# EAGLE design Pacman (EAGLE 9.5.0)
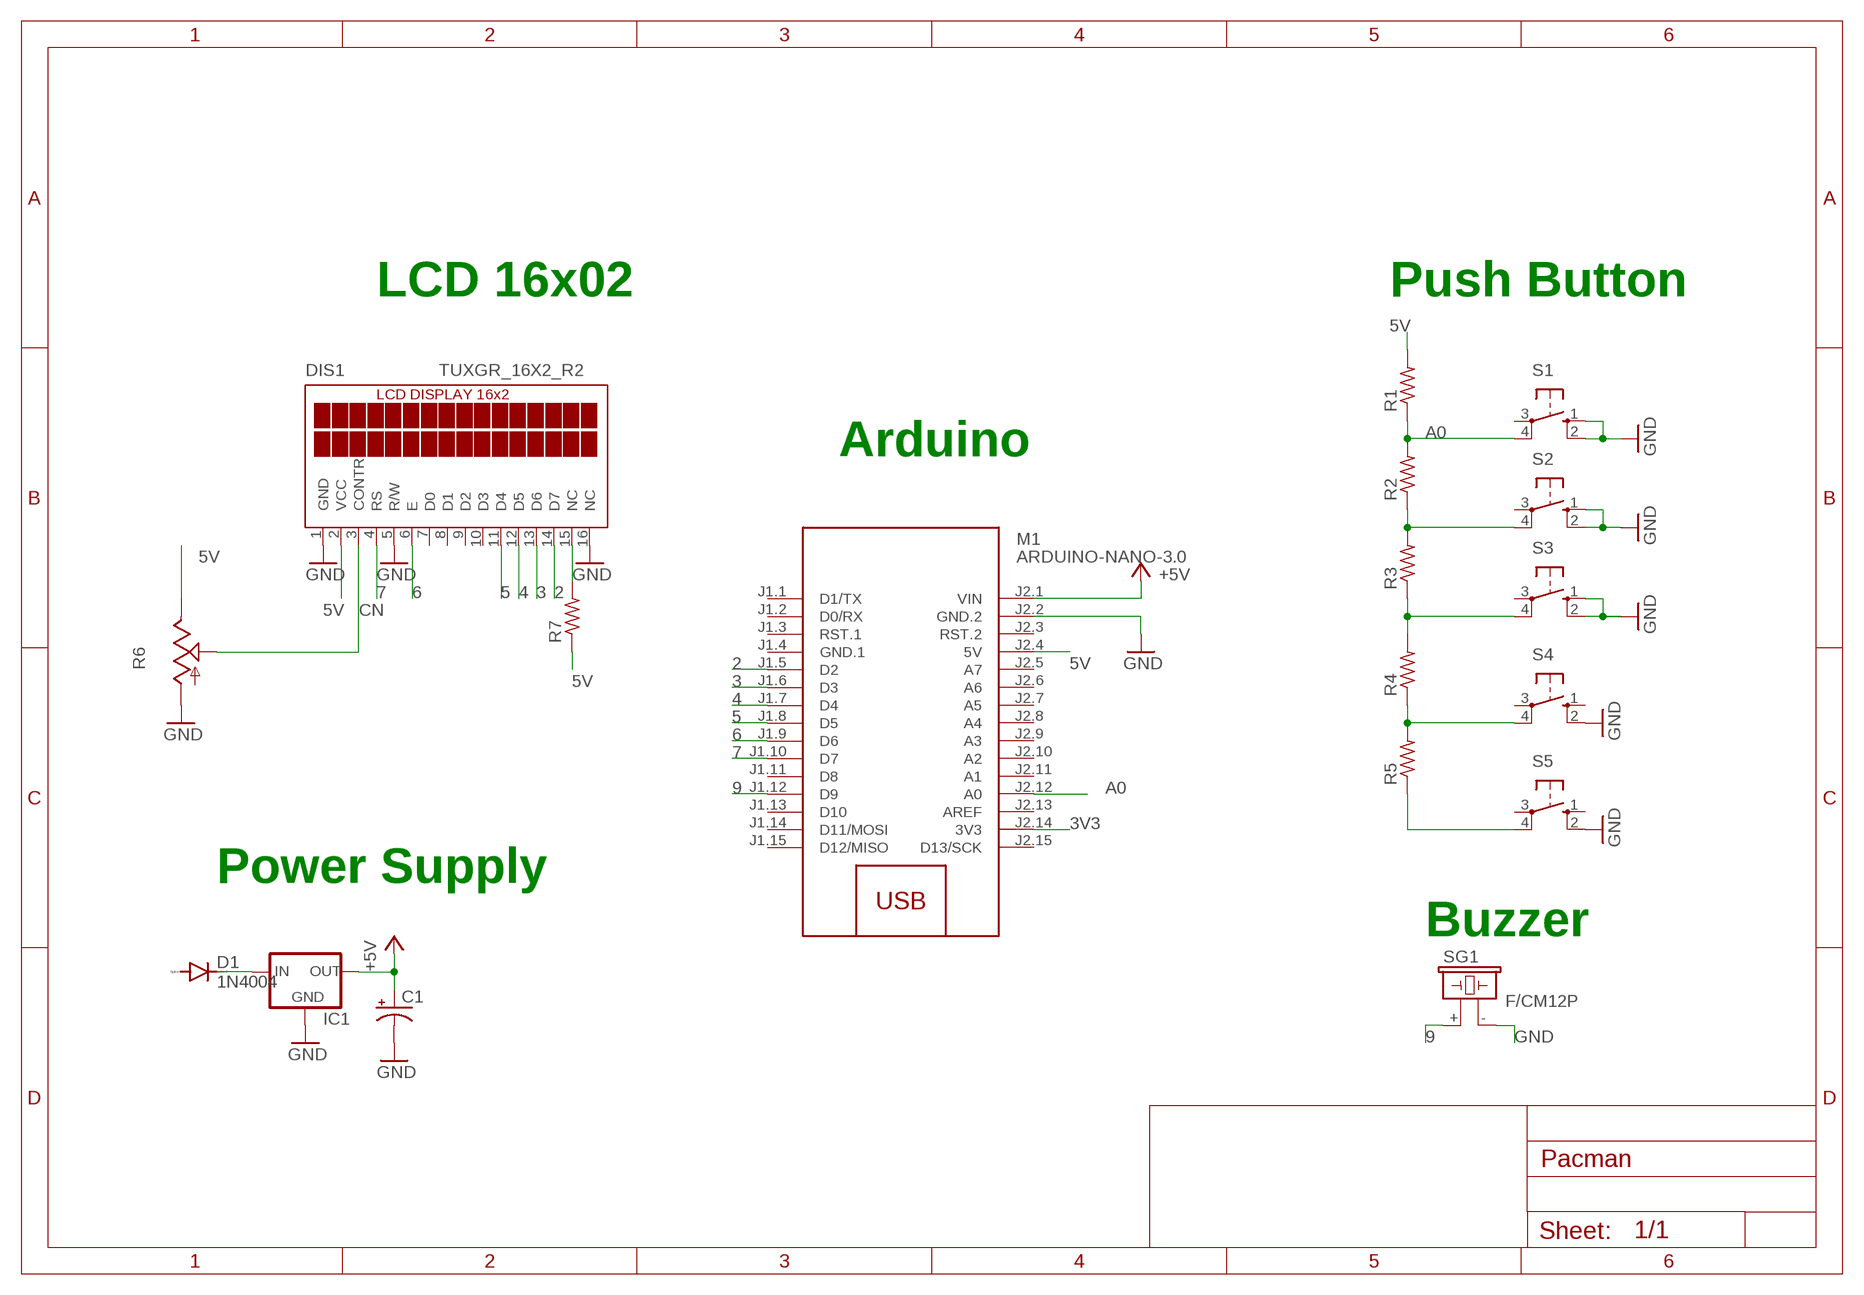
[diagram p0: schematic, sheet 1]

## Parts
C1  CPOL-USE2.5-6  [E2,5-6]
D1  1N4004  [DO41-10]
DIS1  TUXGR_16X2_R2  [TUXGR_16X2_R2]
IC1  78XXS  [78XXS]
M1  ARDUINO-NANO-3.0  [ARDUINO-NANO-3.0]
R1  R-US_0207/7  [0207/7]
R2  R-US_0207/7  [0207/7]
R3  R-US_0207/7  [0207/7]
R4  R-US_0207/7  [0207/7]
R5  R-US_0207/7  [0207/7]
R6  TRIM_US-CA6V  [CA6V]
R7  R-US_0207/7  [0207/7]
S1  10-XX  [B3F-10XX]
S2  10-XX  [B3F-10XX]
S3  10-XX  [B3F-10XX]
S4  10-XX  [B3F-10XX]
S5  10-XX  [B3F-10XX]
SG1  F/CM12P  [F/CM12P]

## Nets
2: DIS1.14(D7) M1.J1.5(D2)
3: DIS1.13(D6) M1.J1.6(D3)
3V3: M1.J2.14(3V3)
4: DIS1.12(D5) M1.J1.7(D4)
5: DIS1.11(D4) M1.J1.8(D5)
5V: DIS1.2(VCC) M1.J2.4(5V) R1.2 R6.E R7.1
6: DIS1.6(E) M1.J1.9(D6)
7: DIS1.4(RS) M1.J1.10(D7)
9: M1.J1.12(D9) SG1.+
+5V: C1.+ IC1.OUT M1.J2.1(VIN)
A0: M1.J2.12(A0) R1.1 R2.2 S1.4(P1)
CN: DIS1.3(CONTR) R6.S
GND: C1.- DIS1.1(GND) DIS1.5(R/W) DIS1.16(NC) IC1.GND M1.J2.2(GND.2) R6.A S1.1(S) S1.2(S1) S2.1(S) S2.2(S1) S3.1(S) S3.2(S1) S4.2(S1) S5.2(S1) SG1.-
N$1: R5.1 S5.4(P1)
N$2: D1.C IC1.IN
N$3: DIS1.15(NC) R7.2
N$4: R2.1 R3.2 S2.4(P1)
N$5: R3.1 R4.2 S3.4(P1)
N$6: R4.1 R5.2 S4.4(P1)
Unconnected: D1.A DIS1.7(D0) DIS1.8(D1) DIS1.9(D2) DIS1.10(D3) M1.J1.1(D1/TX) M1.J1.2(D0/RX) M1.J1.3(RST.1) M1.J1.11(D8) M1.J1.13(D10) M1.J1.14(D11/MOSI) M1.J1.15(D12/MISO) M1.J2.3(RST.2) M1.J2.5(A7) M1.J2.6(A6) M1.J2.7(A5) M1.J2.8(A4) M1.J2.9(A3) M1.J2.10(A2) M1.J2.11(A1) M1.J2.13(AREF) M1.J2.15(D13/SCK) S1.3(P) S2.3(P) S3.3(P) S4.1(S) S4.3(P) S5.1(S) S5.3(P)

## Notes on the sheet
- LCD 16x02 | Push Button
- Arduino
- Power Supply
- Buzzer

## Power pins joined to a net without a drawn wire
GND.1: M1.J1.4(GND.1)

## Library data of the parts
C1 = rcl:CPOL-US: POLARIZED CAPACITOR, American symbol; SPICEPREFIX: C
D1 = diode:1N4004: DIODE general purpose rectifier, 1 A
DIS1 = display-lcd:TUXGR_16X2_R2: Tuxgraphics LCD display 16x2 characters reflective, without background light Source: tuxgr_12x2_r2.pdf; OC_FARNELL: unknown; OC_NEWARK: unknown
IC1 = v-reg:78XXS: VOLTAGE REGULATOR
M1 = diy-modules:ARDUINO-NANO-3.0: Arduino Nano 3.0 and compatible devices More details available here: https://www.arduino.cc/en/Main/ArduinoBoardNano Click here to find device on ebay.com <http://www.ebay.com/sch/arduino+nano>
R1-R5 R7 = rcl:R-US_: RESISTOR, American symbol; SPICEPREFIX: R
R6 = pot:TRIM_US-: POTENTIOMETER
S1-S5 = switch-omron:10-XX: OMRON SWITCH; MPN: B3F-1000; OC_FARNELL: 176432; OC_NEWARK: 36M3542
SG1 = buzzer:F/CM12P: BUZZER Source: Buerklin; OC_FARNELL: unknown; OC_NEWARK: unknown

## Board
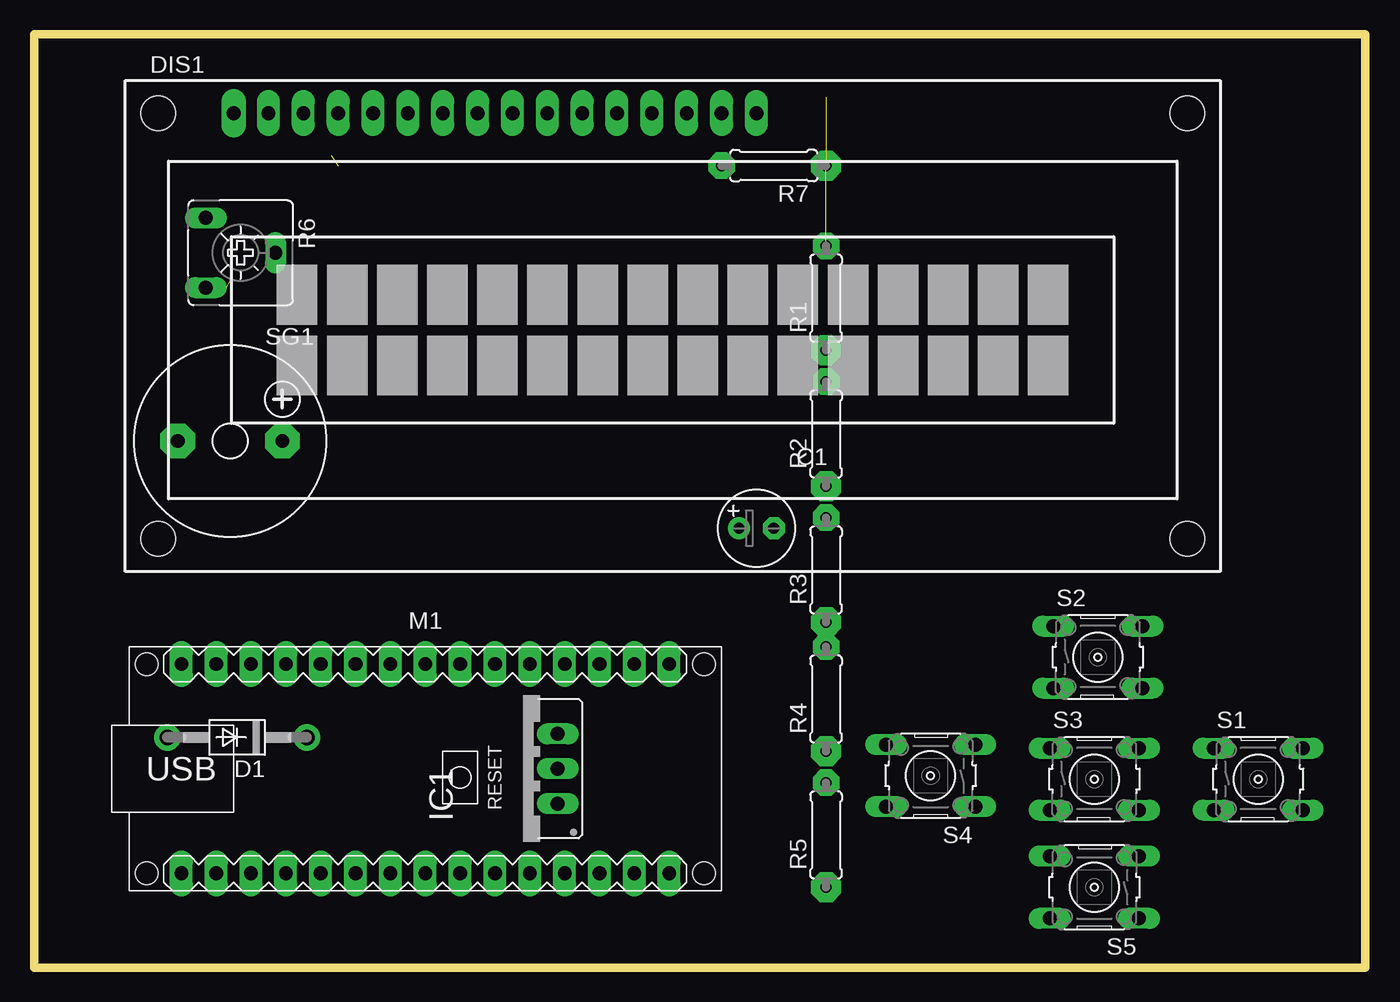
[diagram p1: board, top side]
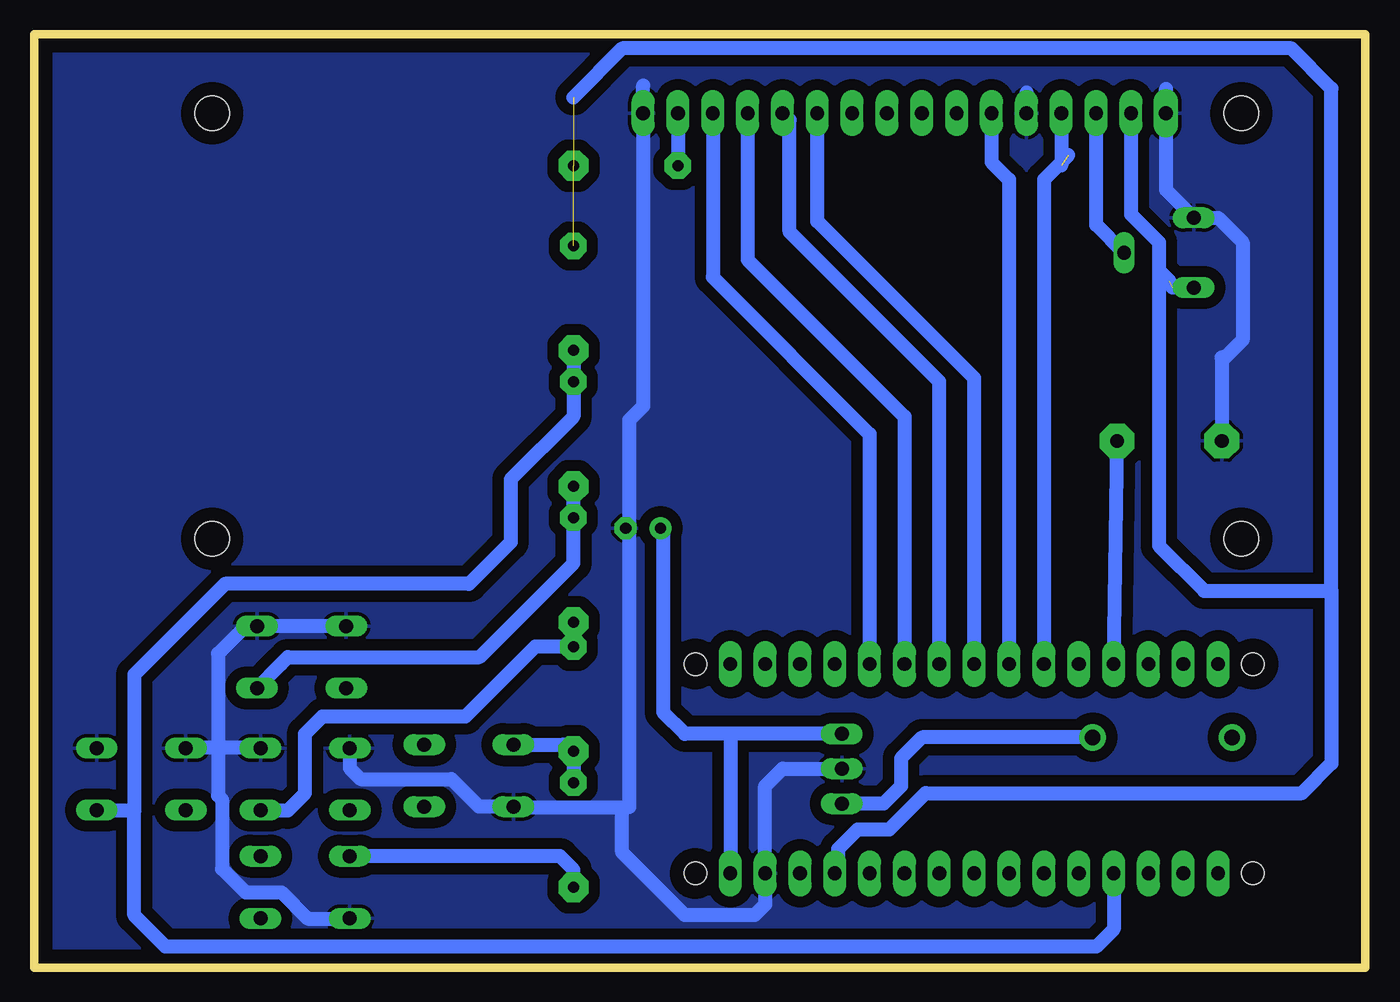
[diagram p2: board, bottom side, seen from below]

Size 97 x 68 mm. Coordinates in mm from the lower left corner, seen from the top.
Outline: 0,0 97,0 97,68 0,68 0,0
Copper layers (1*16): Top 0.035mm / dielectric 1.5mm / Bottom 0.035mm
Design rules "default": minimum track width 6mil, minimum drill 0.35mm, track to track 24mil, track to pad 24mil, pad to pad 24mil, via to via 24mil, smd to smd 24mil, copper to edge 40mil, drill to drill 6mil, minimum pad ring 10mil, minimum via ring 8mil, stop-mask expansion 4mil, vias tented up to drill 0mil, thermal gap 10mil

### Footprints (pad centres in the part's own frame; a part is rotated, then mirrored left to right if it is on the bottom)
E2,5-6 = drill 0.813 pad 1.6: + -1.27,0 | drill 0.813 pad 1.6 octagon: - 1.27,0
DO41-10 = drill 1.118 pad 1.93: A 5.08,0; C -5.08,0
TUXGR_16X2_R2 = drill 1 pad 1.778 long: 1 -32,15.5 | drill 1 pad 1.676 long: 2 -29.46,15.5; 3 -26.92,15.5; 4 -24.38,15.5; 5 -21.84,15.5; 6 -19.3,15.5; 7 -16.76,15.5; 8 -14.22,15.5; 9 -11.68,15.5; 10 -9.14,15.5; 11 -6.6,15.5; 12 -4.06,15.5; 13 -1.52,15.5; 14 1.02,15.5; 15 3.56,15.5; 16 6.1,15.5 | hole 2.5: -37.5,-15.5; 37.5,-15.5; -37.5,15.5; 37.5,15.5
78XXS = drill 1.016 long: GND 0,-2.54; IN -2.54,-2.54; OUT 2.54,-2.54
ARDUINO-NANO-3.0 = drill 1 pad 1.676 long: J1.1 17.78,7.62; J1.2 15.24,7.62; J1.3 12.7,7.62; J1.4 10.16,7.62; J1.5 7.62,7.62; J1.6 5.08,7.62; J1.7 2.54,7.62; J1.8 0,7.62; J1.9 -2.54,7.62; J1.10 -5.08,7.62; J1.11 -7.62,7.62; J1.12 -10.16,7.62; J1.13 -12.7,7.62; J1.14 -15.24,7.62; J1.15 -17.78,7.62; J2.1 17.78,-7.62; J2.2 15.24,-7.62; J2.3 12.7,-7.62; J2.4 10.16,-7.62; J2.5 7.62,-7.62; J2.6 5.08,-7.62; J2.7 2.54,-7.62; J2.8 0,-7.62; J2.9 -2.54,-7.62; J2.10 -5.08,-7.62; J2.11 -7.62,-7.62; J2.12 -10.16,-7.62; J2.13 -12.7,-7.62; J2.14 -15.24,-7.62; J2.15 -17.78,-7.62 | hole 1.651: -20.32,7.62; -20.32,-7.62; 20.32,-7.62; 20.32,7.62
0207/7 = drill 0.813 pad 2.184 octagon: 1 -3.81,0 | drill 0.813 pad 1.93 octagon: 2 3.81,0
CA6V = drill 1.016 long: A -2.54,-2.54; E 2.54,-2.54; S 0,2.54
B3F-10XX = drill 1.016 long: 1 -3.251,2.261; 2 3.251,2.261; 3 -3.251,-2.261; 4 3.251,-2.261
F/CM12P = drill 1.016 pad 2.54 octagon: + 3.81,0; - -3.81,0

### Placement (x,y rotation side)
C1  52.63,32.02 0 top
D1  14.78,16.78 180 top
DIS1  46.53,46.75 0 top
IC1  35.61,14.49 90 top
M1  28.5,14.49 0 top
R1  57.71,48.78 90 top
R2  57.71,38.88 90 top
R3  57.71,28.97 90 top
R4  57.71,19.57 90 top
R5  57.71,9.67 90 top
R6  15.03,52.09 270 top
R7  53.9,58.44 180 top
S1  89.2,13.73 0 top
S2  77.52,22.62 0 top
S3  77.26,13.73 0 top
S4  65.33,13.99 180 top
S5  77.26,5.86 180 top
SG1  14.27,38.37 0 top

### Tracks (layer width: path | path; a pad name or v marks a point on that pad's centre or on a via)
2
  Bottom 1.016: DIS1.14 47.55,50.31 36.12,38.88 M1.J1.5
3
  Bottom 1.016: DIS1.13 45.01,51.58 33.58,40.15 M1.J1.6
4
  Bottom 1.016: M1.J1.7 31.04,42.69 41.96,53.61 41.96,61.74 DIS1.12
5
  Bottom 1.016: M1.J1.8 28.5,42.94 39.93,54.38 DIS1.11
5V  (3 unrouted)
  Bottom 1.016: DIS1.2 17.07,54.88 15.04,52.85 15.04,50.82 | 15.04,50.82 15.04,30.75 11.73,27.45 2.46,27.45 | R6.E 14.02,49.55 | 14.28,50.05 15.04,50.82 | M1.J2.4 38.4,7.13 38.4,8.65 36.98,10.07 34.68,10.07 32.04,12.72 4.62,12.72 2.46,14.88 2.46,27.45 | 2.46,27.45 2.46,64.05 5.38,66.97 54.15,66.97 57.71,63.41
6
  Bottom 1.016: DIS1.6 27.23,58.7 25.96,57.42 M1.J1.9
7  (1 unrouted)
  Bottom 1.016: DIS1.4 22.15,58.43 | M1.J1.10 23.42,57.42 21.64,59.19
9
  Bottom 1.016: M1.J1.12 SG1.+
+5V
  Bottom 1.016: IC1.OUT 46.02,17.03 | 46.02,17.03 46.28,16.78 M1.J2.1 | 46.02,17.03 49.58,17.03 51.16,18.62 51.16,31.83 C1.+
A0
  Bottom 1.016: R1.1 R2.2 57.71,40.15 62.28,35.58 62.28,31 65.33,27.96 83.11,27.96 89.71,21.35 89.71,11.45 | M1.J2.12 18.34,2.81 19.61,1.54 87.42,1.54 89.71,3.83 89.71,11.45 | 89.71,11.45 92.43,11.45 S1.4
CN
  Bottom 1.016: R6.S 19.61,54.12 DIS1.3
GND
  Bottom 1.016: IC1.GND 42.47,14.49 43.74,13.22 M1.J2.2 43.74,4.59 44.5,3.83 49.58,3.83 54.15,8.4 54.15,11.45 | 14.53,64.02 DIS1.1 14.53,56.66 R6.A 10.72,54.63 8.94,52.85 8.94,45.74 10.21,44.47 10.46,44.47 SG1.- | 52.63,64.27 DIS1.16 52.63,40.91 53.64,39.89 53.64,11.69 62.04,11.69 S4.2 | DIS1.5 24.69,63.77 | 81.05,15.99 S3.2 80.54,16.02 83.36,16.02 | 62.79,11.72 S4.2 | 83.36,16.02 85.92,16.02 S1.1 | 83.36,16.02 83.61,16.27 | 83.61,16.27 83.61,22.88 81.61,24.88 S2.2 S2.1 | S3.1 74.01,14.54 73.2,13.73 66.6,13.73 64.59,11.72 S4.2 | 61.26,11.72 S4.2 | 83.61,16.27 83.61,12.55 83.31,12.25 83.31,7.2 81.58,5.48 78.98,5.48 77.07,3.57 73.45,3.57 73.48,3.6 S5.2
  pour Bottom (isolate 0.813): 0.05,68.09 0.05,0.02 97.08,0.02 97.08,68.09
N$1
  Bottom 1.016: R5.1 57.71,7.13 58.7,8.12 S5.4
N$2
  Bottom 1.016: D1.C 32.31,16.78 33.83,15.26 33.83,13.22 35.1,11.95 IC1.IN
N$3
  Bottom 1.016: DIS1.15 R7.2
N$4
  Bottom 1.016: R2.1 R3.2 57.71,29.48 64.56,22.62 78.53,22.62 79.04,22.11 79.04,22.09 S2.4
N$5
  Bottom 1.016: R3.1 R4.2 60.5,23.38 65.58,18.3 75.99,18.3 77.26,17.03 77.26,12.72 78.53,11.45 78.56,11.47 S3.4
N$6
  Bottom 1.016: R5.2 R4.1 57.96,15.76 58.44,16.25 S4.4